# EAGLE design nled-spi-level-shifter-v1a (EAGLE 8.6.0)
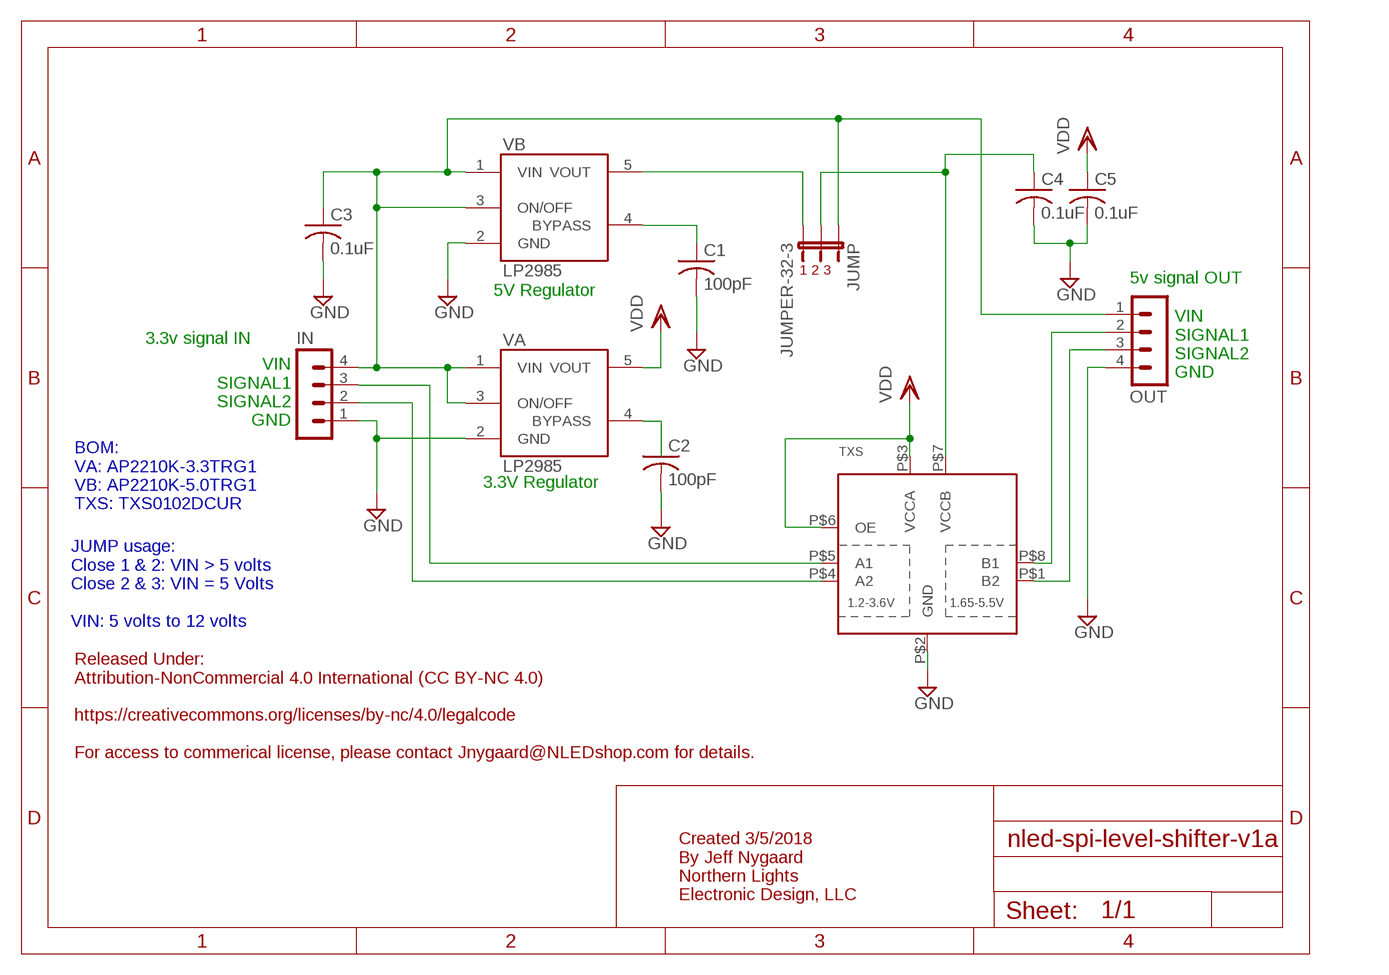
[diagram p0: schematic, sheet 1]

## Parts
C1  100pF  C-USC0805  [C0805]
C2  100pF  C-USC0805  [C0805]
C3  0.1uF  C-USC0805  [C0805]
C4  0.1uF  C-USC0805  [C0805]
C5  0.1uF  C-USC0805  [C0805]
IN  MA04-1  [MA04-1]
JUMP  JUMPER-32-3  [SJ_3_PASTE2&3]
OUT  MA04-1  [MA04-1]
TXS  TXS0102  [VFSOP-8]
VA  LP2985AIM5-3.3  [SOT25]
VB  LP2985AIM5-3.3  [SOT25]

## Nets
BYPASS: C1.1 VB.4(BYPASS)
BYPASSB: C2.1 VA.4(BYPASS)
GND: C1.2 C2.2 C3.2 C4.2 C5.2 IN.1 OUT.4 TXS.P$2(GND) VA.2(GND) VB.2(GND)
N$2: C4.1 JUMP.2 TXS.P$7(VCCB)
N$3: IN.3 TXS.P$5(A1)
N$4: IN.2 TXS.P$4(A2)
N$5: OUT.2 TXS.P$8(B1)
N$6: OUT.3 TXS.P$1(B2)
N$7: JUMP.3 VB.5(VOUT)
VDD: C5.1 TXS.P$3(VCCA) TXS.P$6(OE) VA.5(VOUT)
VIN: C3.1 IN.4 JUMP.1 OUT.1 VA.1(VIN) VA.3(ON/OFF) VB.1(VIN) VB.3(ON/OFF)

## Notes on the sheet
- 1 2 3
- 5v signal OUT
- 5V Regulator
- 3.3v signal IN
- VIN
  SIGNAL1
  SIGNAL2
  GND
- VIN
  SIGNAL1
  SIGNAL2
  GND
- 3.3V Regulator
- BOM:
  VA: AP2210K-3.3TRG1 
  VB: AP2210K-5.0TRG1
  TXS: TXS0102DCUR
- JUMP usage:
  Close 1 & 2: VIN > 5 volts
  Close 2 & 3: VIN = 5 Volts
  
  VIN: 5 volts to 12 volts
- Released Under:
  Attribution-NonCommercial 4.0 International (CC BY-NC 4.0)
  
  https://creativecommons.org/licenses/by-nc/4.0/legalcode
  
  For access to commerical license, please contact Jnygaard@NLEDshop.com for details.
- Created 3/5/2018
  By Jeff Nygaard
  Northern Lights
  Electronic Design, LLC

## Library data of the parts
C1-C5 = rcl:C-US: CAPACITOR, American symbol
IN OUT = ChromationSystems-2:MA04-1: PIN HEADER; OC_FARNELL: unknown; OC_NEWARK: unknown
JUMP = SparkFun:JUMPER-3
TXS = adafruit:TXS0102: 2-Bit Bi-Directional Level Shifter (I2C, etc.) Designed for I2C devices and has internal pullups. Not to be confused with TXB010x series. 1.2V-3.6V (VCCA) to 1.65V-5.5V (VCCB) bi-directional level shifter with auto direction sensing. Max data rate - 24Mbps (Push Pull), 2Mbps (Open Drain) Digikey: 296-21931-1-ND
VA VB = LP2985:LP2985: LP2985-N Micropower 150 mA Low-Noise Ultra Low-Dropout Regulator

## Board
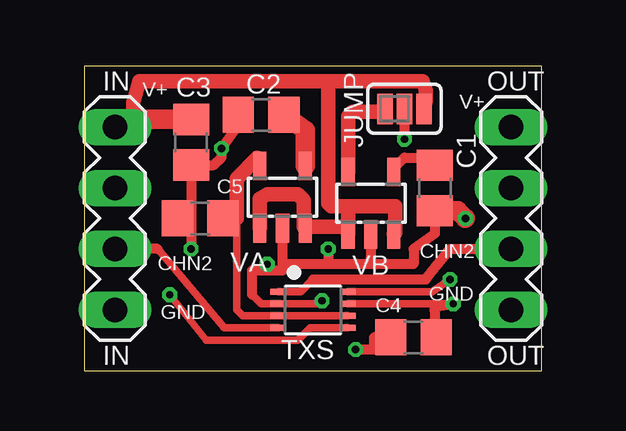
[diagram p1: board, top side]
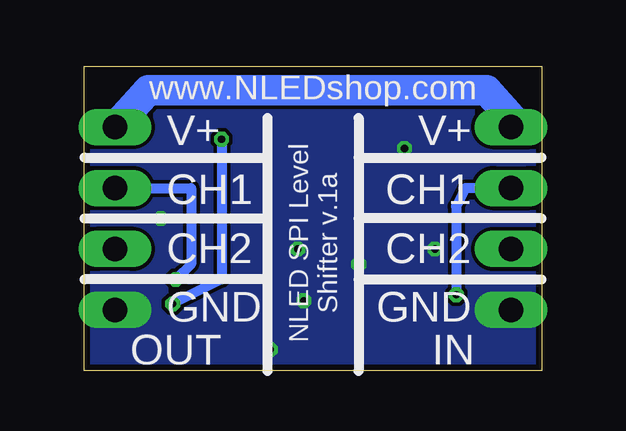
[diagram p2: board, bottom side, seen from below]

Size 19.05 x 12.7 mm. Coordinates in mm from the lower left corner, seen from the top.
Outline: 0,0 19.05,0 19.05,12.7 0,12.7 0,0
Copper layers (1*16): Top 0.035mm / dielectric 1.5mm / Bottom 0.035mm
Design rules "SeeedStudio_2layer_DRU_no_angle_20140221": minimum track width 6mil, minimum drill 12mil, track to track 6mil, track to pad 6mil, pad to pad 6mil, via to via 6mil, smd to smd 0mil, copper to edge 10mil, drill to drill 10mil, minimum pad ring 10mil, minimum via ring 6mil, stop-mask expansion 2mil, vias tented up to drill 100mil, thermal gap 10mil

### Footprints (pad centres in the part's own frame; a part is rotated, then mirrored left to right if it is on the bottom)
C0805 = smd 1.3 x 1.5: 1 -0.95,0; 2 0.95,0
MA04-1 = drill 1.016 long: 1 -3.81,0; 2 -1.27,0; 3 1.27,0; 4 3.81,0
SJ_3_PASTE2&3 = smd 0.635 x 1.27: 1 -0.813,0; 2 0,0; 3 0.813,0
VFSOP-8 = smd 0.25 x 0.65: P$1 -0.75,-1.45; P$2 -0.25,-1.45; P$3 0.25,-1.45; P$4 0.75,-1.45; P$5 0.75,1.45; P$6 0.25,1.45; P$7 -0.25,1.45; P$8 -0.75,1.45
SOT25 = smd 0.55 x 1.2: 1 -0.95,-1.3; 2 0,-1.3; 3 0.95,-1.3; 4 0.95,1.3; 5 -0.95,1.3

### Placement (x,y rotation side)
C1  14.61,7.62 270 top
C2  7.37,10.67 180 top
C3  4.45,9.53 270 top
C4  13.72,1.4 180 top
C5  4.83,6.35 180 top
IN  1.27,6.35 90 top
JUMP  13.34,10.92 180 top
OUT  17.78,6.35 270 top
TXS  9.53,2.54 270 top
VA  8.26,7.24 0 top
VB  11.94,6.99 0 top

### Tracks (layer width: path | path; a pad name or v marks a point on that pad's centre or on a via)
BYPASS
  Top 0.406: VB.4 12.92,8.32 12.92,8.47 13.34,8.89 14.29,8.89 C1.1
BYPASSB
  Top 0.813: VA.4 9.21,10.03 C2.1
GND  (via drill 0.3)
  Top 0.305: TXS.P$2 7.37,2.79 6.99,3.17 | 8,2.79 9.91,2.79 v9.91,2.92
  Top 0.406: 6.99,3.17 6.99,4.19 7.62,4.19 | 7.62,4.19 8.26,4.19 8.26,4.45 | 8.26,4.45 VA.2 | 15.81,6.42 v15.88,6.35 | C3.2 5.4,8.57 5.71,8.89 v5.71,9.27 6.35,10.16 6.35,10.73 C2.2 | VB.2 11.94,4.45 | 11.94,4.45 10.16,4.45 | 10.16,4.45 8.26,4.45 | C1.2 14.61,5.71 13.72,5.08 13.72,4.45 11.94,4.45 | v10.16,5.08 10.16,4.45 | v7.62,4.45 7.62,4.19 | C4.2 12.06,1.4 12.06,0.89 v11.3,0.89 | C5.2 4.45,6.35 | 4.45,6.35 v4.45,5.08 | 4.45,8.26 4.45,6.35
  Top 0.813: C1.2 15.55,6.67 v15.88,6.35
  pour Bottom (no thermals): 0,12.7 0,0 19.05,0 19.05,0.64 19.05,12.7
N$2  (via drill 0.3)
  Top 0.305: TXS.P$7 13.09,2.79 v15.37,2.79
  Top 0.406: JUMP.2 v13.34,9.65 | C4.1 14.61,2.67 v15.37,2.79
  Bottom 0.406: v13.34,9.65 13.34,3.81 v15.37,2.79
N$3  (via drill 0.3)
  Top 0.305: TXS.P$5 9.41,1.79 8.89,1.27 5.08,1.27 v3.56,3.17
  Bottom 0.406: IN.3 3.17,7.62 3.56,6.86 v3.56,3.17
N$4
  Top 0.305: TXS.P$4 5.83,1.79 3.05,5.08
  Top 0.406: 3.05,5.08 IN.2
N$5  (via drill 0.3)
  Top 0.305: TXS.P$8 14.49,3.29 v15.24,3.81
  Bottom 0.406: OUT.2 14.61,7.62 14.61,4.45 v15.24,3.81
N$6
  Top 0.305: TXS.P$1 9.01,3.29 9.53,3.81
  Top 0.406: 9.53,3.81 14.22,3.81 15.24,5.08 OUT.3
N$7
  Top 0.61: VB.5 10.99,10.61 11.18,10.79 12.14,10.79 JUMP.3
VDD
  Top 0.305: 6.35,6.35 6.35,2.54 6.6,2.29 TXS.P$3 TXS.P$6
  Top 0.406: 7.21,8.89 VA.5 | C5.1 6.35,6.35
  Top 0.61: 6.35,6.35 6.35,8 7.21,8.89
VIN
  Top 0.406: 2.34,10.47 2.03,10.16
  Top 0.61: VA.1 7.3,7.18 7.62,7.37 8.89,7.37 9.14,7.11 9.14,6 | 9.14,6 VA.3 | 11.18,6.86 10.99,6.67 VB.1 10.92,6 9.14,6 | 11.18,6.86 12.95,6.86 12.95,5.75 VB.3 | 11.18,6.86 10.29,6.86 10.16,6.99 10.16,12.06 | 10.16,12.06 14.1,12.06 14.22,11.68 14.22,11.25 JUMP.1 | 2.03,10.16 2.03,11.18 2.29,12.06 10.16,12.06
  Top 0.813: IN.4 2.03,10.16 | C3.1 2.34,10.47
  Bottom 1.27: IN.4 1.27,10.54 2.29,11.68 16.38,11.68 OUT.1

### Text on the board
tNames: IN | OUT | V+ | V+ | CHN2 | CHN2 | GND | GND | IN | OUT
bNames: www.NLEDshop.com | V+ / CH1 / CH2 / GND | V+ / CH1 / CH2 / GND | NLED SPI Level / Shifter v.1a | IN | OUT